# EasyEDA Pro project B1S.eprj

# Schematic Schematic1
Board Name: B1S_STD; Create Date: 2025-11-05; Page Name: P1; Project Name: B1S; Schematic Name: Schematic1; Update Date: 2025-11-11; Company: 嘉立创EDA; Page Size: A4; Version: V1.0
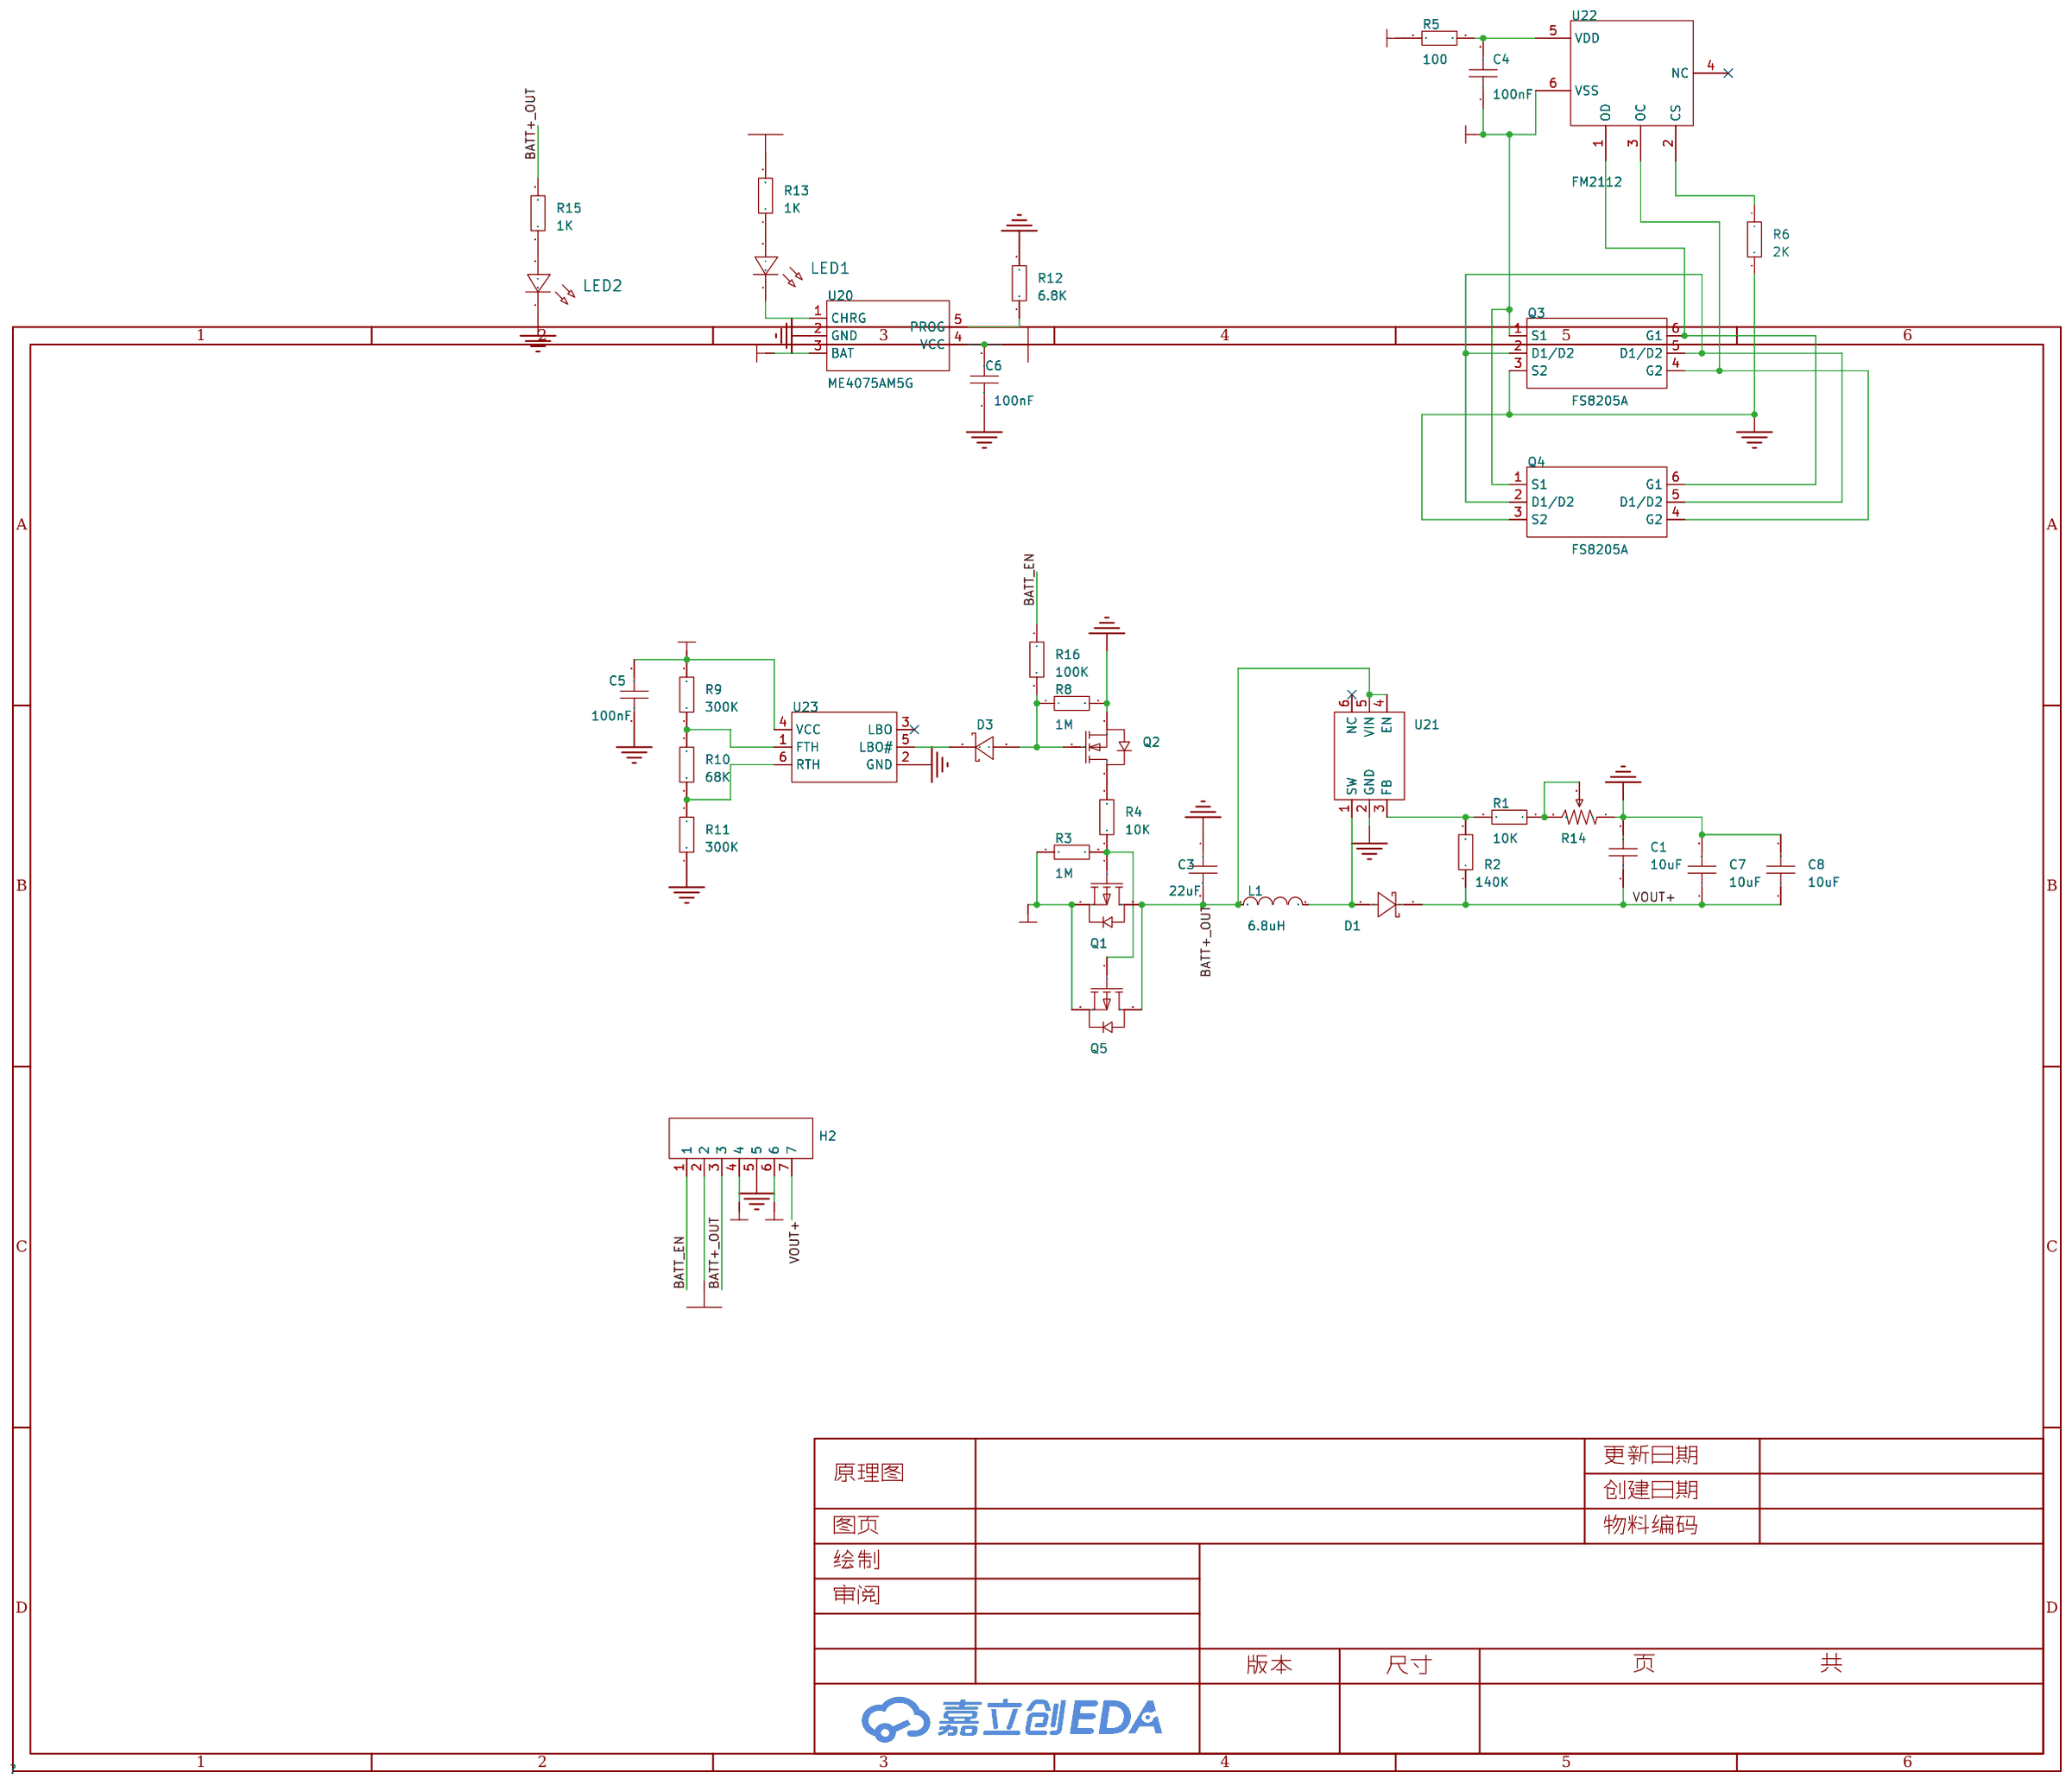
[diagram p0: schematic sheet]

## Parts
C1  10uF  [C0805]
C3  22uF  [C0805]
C4  100nF  [C0603]
C5  100nF  [C0603]
C6  100nF  [C0603]
C7  10uF  [C0805]
C8  10uF  [C0805]
D1  SS34  [SMA_L4.3-W2.6-LS5.0-FD]
D3  1N5819WS  [SOD-323_L1.8-W1.3-LS2.5-RD]
H2  -  [HDR-TH_7P-P2.54-V-F]
L1  6.8uH  [IND-SMD_L7.0-W6.6]
LED1  -  [LED_0603]
LED2  -  [LED_0603]
Q1  SI2305CDS-T1-GE3  [SOT-23-3_L2.9-W1.3-P1.90-LS2.4-BR]
Q2  SI2302  [SOT-23-3_L2.9-W1.3-P1.90-LS2.4-BR]
Q3  FS8205A  [SOT-23-6_L2.9-W1.6-P0.95-LS2.8-BR]
Q4  FS8205A  [SOT-23-6_L2.9-W1.6-P0.95-LS2.8-BR]
Q5  SI2305CDS-T1-GE3  [SOT-23-3_L2.9-W1.3-P1.90-LS2.4-BR]
R1  10K  [R0603]
R2  140K  [R0603]
R3  1M  [R0603]
R4  10K  [R0603]
R5  100  [R0603]
R6  2K  [R0603]
R8  1M  [R0603]
R9  300K  [R0603]
R10  68K  [R0603]
R11  300K  [R0603]
R12  6.8K  [R0603]
R13  1K  [R0603]
R14  500kΩ  [RES-ADJ-SMD_JER33X-1-14]
R15  1K  [R0603]
R16  100K  [R0603]
U20  ME4075AM5G  [SOT-23-5_L2.9-W1.6-P0.95-LS2.8-BL]
U21  SX1308  [SOT-23-6_L2.9-W1.6-P0.95-LS2.8-BL]
U22  FM2112  [SOT-23-6_L2.9-W1.6-P0.95-LS2.8-BL]
U23  CN312  [SOT-23-6_L2.9-W1.6-P0.95-LS2.8-BL]

## Library data of the parts
C1 C3 C7 C8 = CAP_0805: Supplier Footprint: 0805
C4-C6 = CAP_0603: Supplier Footprint: 0603
D1 = SS34_C7420365: LCSC Part Name: 电压:40V 电流:3A; Supplier Part: C7420365; Manufacturer: R+O(宏嘉诚); Supplier Footprint: SMA(DO-214AC); JLCPCB Part Class: 扩展库; Datasheet: https://item.szlcsc.com/datasheet/SS34/8397187.html; Supplier: LCSC; Diode Configuration: 独立式; Voltage - Forward(Vf@If): 550mV@3.0A; Voltage - DC Reverse(Vr): 40V; Current - Rectified: 3A; Reverse Leakage Current (Ir): 200uA@40V
D3 = 1N5819WS_C191023: LCSC Part Name: 电压:40V 电流:1A; Supplier Part: C191023; Manufacturer: Hottech(合科泰); Supplier Footprint: SOD-323; JLCPCB Part Class: 基础库; Datasheet: https://item.szlcsc.com/datasheet/1N5819WS/213850.html; Supplier: LCSC; Voltage - Forward(Vf@If): 600mV@1A; Voltage - DC Reverse(Vr): 40V; Current - Rectified: 1A; Non-Repetitive Peak Forward Surge Current: 25A
H2 = HDR-F_2.54_1x7P: Supplier Part: C124418; Supplier Footprint: 插件
L1 = FXL0630-6R8-M: LCSC Part Name: 6.8uH ±20% 6A; Supplier Part: C167221; Manufacturer: cjiang(长江微电); Supplier Footprint: SMD,7x6.6mm; JLCPCB Part Class: 扩展库; Datasheet: https://item.szlcsc.com/datasheet/FXL0630-6R8-M/178604.html; Supplier: LCSC; Tolerance: ±20%; Current Rating: 5A; Current - Saturation(Isat): 6A; DC Resistance(DCR): 48mΩ; Type: 一体成型电感
LED1 LED2 = LED_0603-R: Supplier Footprint: 0603
Q1 Q5 = SI2305CDS-T1-GE3: LCSC Part Name: 1个P沟道 耐压:8V 电流:4.4A; Supplier Part: C37577; Manufacturer: VISHAY(威世); Supplier Footprint: SOT-23; JLCPCB Part Class: 扩展库; Datasheet: https://item.szlcsc.com/datasheet/SI2305CDS-T1-GE3/38557.html; Supplier: LCSC; Number: 1个P沟道; Drain to Source Voltage: 8V; Current - Continuous Drain(Id): 5.8A; RDS(on): 65mΩ@1.8V; Pd - Power Dissipation: 1.7W; Gate Threshold Voltage (Vgs(th)): 1V@250uA; Gate Charge(Qg): 30nC@8V; Input Capacitance(Ciss): 96pF; Reverse Transfer Capacitance (Crss@Vds): 300pF; Operating Temperature: -55℃~+150℃; Type: P沟道; Output Capacitance(Coss): 330pF
Q2 = SI2302_C2891732: LCSC Part Name: N沟道,电流:3A,耐压:20V; Supplier Part: C2891732; Manufacturer: YONGYUTAI(永裕泰); Supplier Footprint: SOT-23; JLCPCB Part Class: 扩展库; Datasheet: https://item.szlcsc.com/datasheet/SI2302/3119651.html; Supplier: LCSC; Number: 1个N沟道; Drain to Source Voltage: 20V; Current - Continuous Drain(Id): 3A; RDS(on): 65mΩ@2.5V; Pd - Power Dissipation: 1W; Gate Threshold Voltage (Vgs(th)): 1V@250uA; Gate Charge(Qg): 4nC@4.5V; Input Capacitance(Ciss): 300pF; Reverse Transfer Capacitance (Crss@Vds): 80pF; Operating Temperature: -55℃~+150℃; Type: N沟道; Output Capacitance(Coss): 120pF
Q3 Q4 = FS8205A_C908265: LCSC Part Name: 2个N沟道 耐压:20V 电流:6A; Supplier Part: C908265; Manufacturer: FUXINSEMI(富芯森美); Supplier Footprint: SOT-23-6L; JLCPCB Part Class: 扩展库; Datasheet: https://atta.szlcsc.com/upload/public/pdf/source/20201027/C908265_C6F1A5E0FB14735EF799FEF607A99450.pdf; Supplier: LCSC; Type: 2个N沟道; Drain to Source Voltage: 20V; Current - Continuous Drain(Id): 6A; RDS(on): 18mΩ@4.5V,6A; Pd - Power Dissipation: 1.5W; Gate Threshold Voltage (Vgs(th)@Id): 1.2V; Gate Charge(Qg): 11nC@4.5V; Input Capacitance(Ciss@Vds): 800pF@8V; Reverse Transfer Capacitance (Crss@Vds): 125pF@8V; Operating Temperature: -55℃~+150℃@(Tj)
R1-R6 R8-R13 R15 R16 = Res_0603: Supplier Footprint: 0603
R14 = JER33X-1-55: Supplier Part: C48997889; Manufacturer: JIERR(捷而瑞); Supplier Footprint: SMD-3P,3.4x3.1mm; JLCPCB Part Class: 扩展库; Datasheet: https://item.szlcsc.com/datasheet/JER33X-1-55/51342025.html; Supplier: LCSC; Tolerance: ±25%; Power(Watts): 150mW; Temperature Coefficient: ±250ppm/℃; Number of Turns: 1
U20 = ME4075AM5G: LCSC Part Name: 单节磷酸铁锂电池充电芯片; Supplier Part: C558564; Manufacturer: MICRONE(南京微盟); Supplier Footprint: SOT-23-5; JLCPCB Part Class: 扩展库; Datasheet: https://atta.szlcsc.com/upload/public/pdf/source/20200525/C558564_88164DE9DE160E2D6FBDFD2D9E6A2859.pdf; Supplier: LCSC
U21 = SX1308: 功能类型:升压型;输出类型:可调;工作电压:2V~24V;输出电压:28V;输出电流:2A;; LCSC Part Name: 高效1.2MHz 2A升压转换器; Supplier Part: C78162; Manufacturer: SX(硕芯科技); Supplier Footprint: SOT-23-6; JLCPCB Part Class: 扩展库; Datasheet: https://atta.szlcsc.com/upload/public/pdf/source/20160920/1474356679185.pdf; Supplier: LCSC; Function: 升压型; Output Type: 可调; Voltage - Supply: 2V~24V; Output Voltage: 28V; Output Current: 2A; Frequency - Switching: 1.2MHz; Operating Temperature: -40℃~+85℃; Synchronous Rectifier: 否; Number of Outputs: 1; Topology: 升压式; Quiescent Current: 100uA; Switch tube (built-in/external): 内置
U22 = FM2112: Supplier Part: C255533; Manufacturer: FM(富满); Supplier Footprint: SOT-23-6; JLCPCB Part Class: 扩展库; Supplier: LCSC
U23 = CN312: Supplier Part: C7495114; Manufacturer: CONSONANCE(上海如韵); Supplier Footprint: SOT-23-6L; JLCPCB Part Class: 扩展库; Datasheet: https://atta.szlcsc.com/upload/public/pdf/source/20230915/A8641F2176FA560F6A2DB41CB2D84827.pdf; Supplier: LCSC

## Nets
GND: C1.2 C3.1 C5.1 C6.1 C7.2 C8.2 H2.5 LED2.1(C) Q2.2(S) Q3.3(S2) Q4.3(S2) R6.2 R8.2 R11.1 R12.2 R14.1 U20.2(GND) U21.2(GND) U23.2(GND)
BATT+: C5.2 H2.4 Q1.2(S) Q5.2(S) R3.1 R5.2 R9.2 U20.3(BAT) U23.4(VCC)
BATT+_OUT: C3.2 H2.3 L1.1 Q1.3(D) Q5.3(D) R15.2 U21.4(EN) U21.5(VIN)
BATT-: C4.1 H2.6 Q3.1(S1) Q4.1(S1) U22.6(VSS)
BATT_EN: H2.1 R16.1
CHG+: C6.2 H2.2 R13.2 U20.4(VCC)
VOUT+: C1.1 C7.1 C8.1 D1.2(K) H2.7 R2.1
$1N326: D1.1(A) L1.2 U21.1(SW)
$1N1131: Q1.1(G) Q5.1(G) R3.2 R4.1
$1N1181: Q2.3(D) R4.2
$1N1291: C4.2 R5.1 U22.5(VDD)
$1N2008: Q3.2(D1/D2) Q3.5(D1/D2) Q4.2(D1/D2) Q4.5(D1/D2)
$1N2061: Q3.4(G2) Q4.4(G2) U22.3(OC)
$1N2106: R6.1 U22.2(CS)
$1N3605: R9.1 R10.2 U23.1(FTH)
$1N3631: R10.1 R11.2 U23.6(RTH)
$1N3871: R12.1 U20.5(PROG)
$1N4089: LED1.1(C) U20.1(CHRG)
$1N4116: LED1.2(A) R13.1
$1N6899: LED2.2(A) R15.1
Net-(D3-1): D3.1(K) U23.5(LBO#)
Net-(D3-2): D3.2(A) Q2.1(G) R8.1 R16.2
Net-(Q3-6): Q3.6(G1) Q4.6(G1) U22.1(OD)
Net-(R1-1): R1.1 R14.2 R14.3
Net-(R1-2): R1.2 R2.2 U21.3(FB)

Not connected (* = marked no-connect by the designer): U21 6(NC)*; U22 4(NC)*; U23 3(LBO)*

# Board PCB1
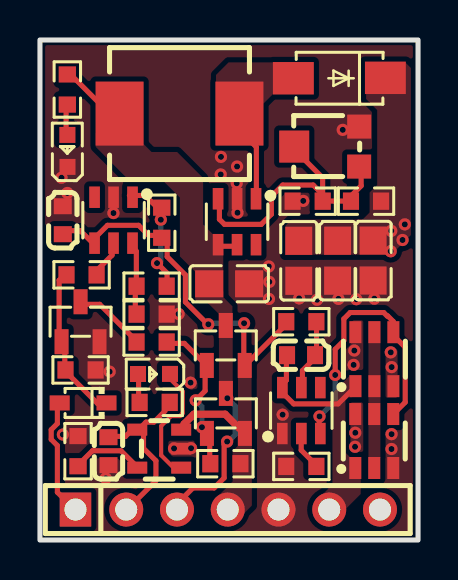
[diagram p1: board, top side]
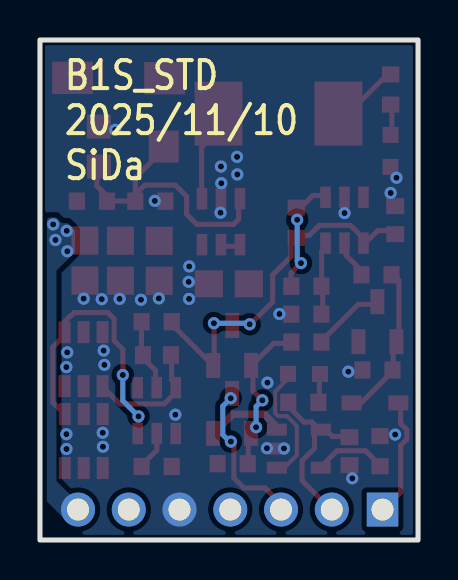
[diagram p2: board, bottom side, seen from below]

Outline 18.92 x 25.02 mm; copper layers: Top Layer, Bottom Layer. Coordinates in mm from the lower left corner of the outline.
Outline path: rectangle 0,25.02 18.92,0
Stack: Top Layer 0.035mm / Dielectric1 1.51mm FR4 er 4.5 / Bottom Layer 0.035mm

## Design rules (mm)
template: 自定义配置
spacing copperThickness1oz (default): track to track 0.102, other pairs 0.152 to 0.3
spacing copperThickness2oz: track to track 0.203, other pairs 0.152 to 0.3
track width copperThickness1oz (default): min 0.127, default 0.254, max 2.54
track width copperThickness2oz: min 0.203, default 0.254, max 2.54
differential pair differentialPair (default): width min 0.127, default 0.254, max 2.54; gap min 0.152, default 0.152
via viaSize (default): diameter min 0.5, default 0.61, max 10; hole min 0.3, default 0.305, max 6.3

## Placement (name value [footprint] x y rotation side)
C1  10uF  [C0805]  12.95 13.97 270 top
C3  22uF  [C0805]  9.47 12.82 180 top
C4  100nF  [C0603]  13.07 9.25 0 top
C5  100nF  [C0603]  1.14 16 270 top
C6  100nF  [C0603]  3.43 4.45 90 top
C7  10uF  [C0805]  16.67 13.98 270 top
C8  10uF  [C0805]  14.9 13.98 270 top
D1  SS34  [SMA_L4.3-W2.6-LS5.0-FD]  14.99 23.11 0 top
D2  1N5819WS  [SOD-323_L1.8-W1.3-LS2.5-RD]  2.16 6.86 180 top
H2  -  [HDR-TH_7P-P2.54-V-F]  9.4 1.52 0 top
L1  6.8uH  [IND-SMD_L7.0-W6.6]  6.99 21.34 0 top
LED1  -  [LED_0603]  5.66 8.3 180 top
LED2  -  [LED_0603]  1.37 19.52 90 top
Q1  SI2305CDS-T1-GE3  [SOT-23-3_L2.9-W1.3-P1.90-LS2.4-BR]  9.3 9.74 270 top
Q2  SI2302  [SOT-23-3_L2.9-W1.3-P1.90-LS2.4-BR]  2.03 10.92 270 top
Q3  FS8205A  [SOT-23-6_L2.9-W1.6-P0.95-LS2.8-BR]  16.74 9.05 270 top
Q4  FS8205A  [SOT-23-6_L2.9-W1.6-P0.95-LS2.8-BR]  16.73 4.95 270 top
Q5  SI2305CDS-T1-GE3  [SOT-23-3_L2.9-W1.3-P1.90-LS2.4-BR]  9.31 6.34 270 top
R1  10K  [R0603]  13.4 16.95 0 top
R2  140K  [R0603]  16.32 16.95 180 top
R3  1M  [R0603]  9.28 3.82 180 top
R4  10K  [R0603]  5.59 9.91 180 top
R5  100  [R0603]  13.08 10.92 180 top
R6  2K  [R0603]  13.08 3.68 180 top
R7  100K  [R0603]  2.08 13.27 0 top
R8  1M  [R0603]  2.03 8.51 0 top
R9  300K  [R0603]  6.1 15.88 270 top
R10  68K  [R0603]  5.59 12.7 0 top
R11  300K  [R0603]  5.59 11.3 180 top
R12  6.8K  [R0603]  1.91 4.45 90 top
R13  1K  [R0603]  5.74 6.89 0 top
R14  500kΩ  [RES-ADJ-SMD_JER33X-1-14]  14.35 19.69 90 top
R15  1K  [R0603]  1.37 22.54 90 top
U20  ME4075AM5G  [SOT-23-5_L2.9-W1.6-P0.95-LS2.8-BL]  5.97 4.57 90 top
U21  SX1308  [SOT-23-6_L2.9-W1.6-P0.95-LS2.8-BL]  9.87 15.93 180 top
U22  FM2112  [SOT-23-6_L2.9-W1.6-P0.95-LS2.8-BL]  13.08 6.48 0 top
U23  CN312  [SOT-23-6_L2.9-W1.6-P0.95-LS2.8-BL]  3.68 16 180 top

## Footprints (pads in the part's own frame, mm; a bottom-side part is the same pattern mirrored in y, then rotated)
C0603
  rect 0.8x0.9 smd: 1(-0.7,0) 2(0.7,0)
C0805
  rect 1.41x1.35 smd: 1(-1,0) 2(1,0)
HDR-TH_7P-P2.54-V-F
  rect 1.575x1.7 hole 1.1: 1(-7.62,0)
  round 1.7 hole 1.1: 2(-5.08,0) 3(-2.54,0) 4(0,0) 5(2.54,0) 6(5.08,0) 7(7.62,0)
IND-SMD_L7.0-W6.6
  rect 2.4x3.2 smd: 1(-3,0) 2(3,0)
LED_0603
  rect 0.8x0.8 smd: 1(-0.851,-0.01) 2(0.75,-0.005)
R0603
  rect 0.806x0.864 smd: 1(-0.753,0) 2(0.753,0)
RES-ADJ-SMD_JER33X-1-14
  rect 1.2x1.2 smd: 1(1,-1.625) 3(-1,-1.625)
  rect 1.6x1.5 smd: 2(0,1.625)
SMA_L4.3-W2.6-LS5.0-FD
  rect 2.046x1.62 smd: 1(-2.304,-0.009) 2(2.304,0.009)
SOD-323_L1.8-W1.3-LS2.5-RD
  rect 1x0.75 smd: 1(-1.173,0) 2(1.173,0)
SOT-23-3_L2.9-W1.3-P1.90-LS2.4-BR
  rect 1.25x0.7 smd: 1(1,-0.95) 2(1,0.95) 3(-1,0)
SOT-23-5_L2.9-W1.6-P0.95-LS2.8-BL
  rect 0.6x1 smd: 1(-0.95,-1.1) 2(0,-1.1) 3(0.95,-1.1) 4(0.95,1.1) 5(-0.95,1.1)
SOT-23-6_L2.9-W1.6-P0.95-LS2.8-BL
  rect 0.532x1.072 smd: 1(-0.95,-1.149) 2(0,-1.149) 3(0.95,-1.149) 4(0.95,1.149) 5(0,1.149) 6(-0.95,1.149)
SOT-23-6_L2.9-W1.6-P0.95-LS2.8-BR
  rect 1.1x0.6 smd: 1(1.35,-0.95) 2(1.35,0) 3(1.35,0.95) 4(-1.35,0.95) 5(-1.35,0) 6(-1.35,-0.95)

## Nets
GND: C1.2 C3.1 C5.1 C6.1 C7.2 C8.2 H2.5 LED2.1 Q2.2 Q3.3 Q3.6 Q4.3 Q4.6 R1.1 R6.2 R8.2 R11.1 R12.2 R14.1 U20.2 U21.2 U22.1 U23.2
BATT+: C5.2 H2.4 Q1.2 Q5.2 R3.1 R5.2 R9.2 U20.3 U23.4
BATT+_OUT: C3.2 H2.3 L1.1 Q1.3 Q5.3 R15.2 U21.4 U21.5
BATT-: C4.1 H2.6 Q3.1 Q4.1 U22.6
BATT_EN: D2.2 H2.1
CHG+: C6.2 H2.2 R13.2 U20.4
VOUT+: C1.1 C7.1 C8.1 D1.2 H2.7 R2.1
$1N326: D1.1 L1.2 U21.1
$1N498: R1.2 R2.2 R14.2 R14.3 U21.3
$1N1131: Q1.1 Q5.1 R3.2 R4.1
$1N1181: Q2.3 R4.2
$1N1291: C4.2 R5.1 U22.5
$1N2008: Q3.2 Q3.5 Q4.2 Q4.5
$1N2061: Q3.4 Q4.4 U22.3
$1N2106: R6.1 U22.2
$1N2767: D2.1 Q2.1 R7.1 R8.1
$1N3605: R9.1 R10.2 U23.1
$1N3631: R10.1 R11.2 U23.6
$1N3806: R7.2 U23.5
$1N3871: R12.1 U20.5
$1N4089: LED1.1 U20.1
$1N4116: LED1.2 R13.1
$1N6899: LED2.2 R15.1

Pads without a net: U21 6; U22 4; U23 3

## Via types
v1: diameter 0.61, hole 0.305, Top Layer to Bottom Layer, 48 vias

## Routing (per net, layer and track width the routed paths; a pad name or vN(x,y) marks a point on that pad's centre or on a via; arc(x,y) is an arc through that point)
GND:
  vias: v1(1.08,18.13) v1(1.15,5.28) v1(1.37,17.36) v1(3.29,3.09) v1(3.49,8.42) v1(3.68,16.36) v1(6.71,4.58) v1(6.94,11.31) v1(7.54,7.87) v1(7.56,4.59) v1(9.06,19.17) v1(9.05,18.29) v1(9.87,18.69) v1(9.85,17.85) v1(9.89,16.38) v1(11.45,13.69) v1(11.48,12.92) v1(11.46,12.06) v1(12.15,6.27) v1(12.97,12.09) v1(13.18,16.97) v1(13.87,12.02) v1(14.94,12.06) v1(15.15,20.52) v1(15.7,8.76) v1(15.73,9.48) v1(15.78,5.37) v1(15.77,4.67) v1(15.83,12.05) v1(16.74,12.08) v1(17.56,9.39) v1(17.6,8.65) v1(17.6,5.3) v1(17.59,4.55)
BATT+: length 21
  Top Layer w0.254: 5.95,15.24 5.44,15.24 4.94,15.75 3.38,15.75 2.65,15.01 2.65,15 2.75,14.89 ; 10.37,8.84 12.12,10.59 12.12,10.94 ; 1.26,15.48 2.02,15.48 2.74,14.76 ; 6.37,14.92 6.37,14.17 7.28,13.26 7.28,11.91 8.43,10.76 ; v1(10.22,10.85) 10.2,10.83 10.2,8.84
  Top Layer w0.363: 7.21,5.48 7.21,5.81 7.7,6.29 9.27,6.29 9.97,5.59
  Bottom Layer w0.254: v1(8.43,10.8) 8.48,10.85 v1(10.22,10.85)
BATT+_OUT: length 11.2
  Top Layer w0.254: 6.93,1.88 7.66,2.61 8.72,2.61 9.22,3.11 9.22,4.77 v1(9.37,4.93) ; 1.39,23.34 1.49,23.34 3.52,21.31 ; 8.93,14.7 9.78,14.7 9.87,14.79
  Bottom Layer w0.254: v1(9.37,4.93) 9.43,4.93 9.77,5.27 9.77,6.7 v1(9.38,7.09)
BATT-: length 5.6
  Top Layer w0.254: 15.72,7.61 14.92,6.81 12.7,6.81 12.23,7.28 12.23,7.42 ; 12.13,7.79 12.34,8 12.34,9.18
BATT_EN: length 6
  Top Layer w0.254: 1.82,1.44 0.87,2.39 0.87,4.73 0.56,5.04 0.56,5.52 0.87,5.83 0.87,6.62 0.77,6.73
CHG+: length 7.4
  Top Layer w0.254: 5,5.59 5.31,5.9 5.7,5.9 6.26,6.46 ; 3.5,5.18 4.28,5.18 4.6,5.5 ; 5.18,5.4 5.18,4.59 5.8,3.97 5.8,2.97 4.47,1.63
VOUT+:
  vias: v1(17.58,15.47) v1(17.55,14.45) v1(18.15,15.01) v1(18.26,15.79)
$1N326: length 3.1
  Top Layer w0.254: 10.46,20.04 10.83,19.66 10.83,17.11
$1N498: length 14.1
  Top Layer w0.254: 12.73,19.55 14.15,18.12 14.15,16.96 ; 14.14,16.96 14.15,16.96 ; 14.15,16.96 15.31,16.96 16.08,17.72 16.08,18.58 ; 14.15,16.96 14.15,16.92 ; 8.98,17.04 8.98,16.05 9.24,15.79 11.08,15.79 11.58,16.3 11.58,17.19 12.15,17.76 13.68,17.76 14.14,17.3
$1N1131: length 6.9
  Top Layer w0.254: 8.27,8.43 8.27,7.46 v1(7.79,6.99) ; 8.5,3.85 8.5,5.05 8.32,5.23 ; 8.27,8.79 7.23,9.84 6.39,9.84
  Bottom Layer w0.254: v1(7.79,6.99) 8.11,6.68 v1(8.11,5.64)
$1N1181: length 3.3
  Top Layer w0.254: 2.19,11.79 2.99,11.79 4.75,10.03
$1N1291: length 3.2
  Top Layer w0.254: 13.82,10.88 13.84,10.86 13.84,9.27 ; 13.69,9.03 13.14,8.48 13.14,7.68
$1N2061: length 13.3
  Top Layer w0.254: 17.63,6.47 17.86,6.47 18.28,6.89 18.28,9.64 17.91,10.01 ; 17.68,10.77 17.68,10.94 17.41,11.21 17.38,11.21 17.21,11.38 15.53,11.38 15.21,11.06 15.21,9.98 14.78,9.54 v1(14.78,8.26) ; v1(13.99,6.19) 13.97,6.17 13.97,5.36
  Bottom Layer w0.254: v1(13.99,6.19) 14.78,6.97 v1(14.78,8.26)
$1N2106: length 1.7
  Top Layer w0.254: 13.07,5.13 13.07,4.5 13.84,3.73
$1N2767: length 7.5
  Top Layer w0.254: 1.17,9.96 1.24,9.88 1.24,8.41 ; 1.32,13.36 0.96,13 0.96,10.18 ; 3.39,6.83 2.89,6.83 1.41,8.3
$1N3605: length 5.8
  Top Layer w0.254: 5.96,16.54 5.27,17.24 4.48,17.24 ; 6.36,12.87 6.36,13.35 v1(5.86,13.86) ; v1(6.05,16.03) 6.01,16.06 6.01,16.52
  Bottom Layer w0.254: v1(5.86,13.86) 5.95,13.86 6.05,13.96 v1(6.05,16.03)
$1N3631: length 3.4
  Top Layer w0.254: 4.77,12.75 4.77,11.59 5.03,11.33 ; 4.82,12.83 4.82,14.44 4.62,14.65
$1N3806: length 1.5
  Top Layer w0.254: 3.61,14.57 3.61,14.25 2.77,13.41
$1N3871: length 3.4
  Top Layer w0.254: 2.01,3.86 2.62,4.47 4.06,4.47 4.85,3.67
$1N4089: length 6.1
  Top Layer w0.203: 6.95,3.61 6.7,3.61 6.07,4.24 6.07,5.71 6.56,6.2 7,6.2 7.15,6.35 7.15,7.42 6.56,8.02 6.56,8.21
$1N4116: length 1.4
  Top Layer w0.254: 4.97,8.19 4.94,8.16 4.94,6.8
$1N6899: length 1.3
  Top Layer w0.254: 1.39,21.6 1.31,21.52 1.31,20.36

## Copper pours and planes (outline as drawn; the poured copper is in the pictures)
GND on Top Layer: -0.47,25.47 19.64,25.47 19.64,-0.92 -0.47,-0.92
GND on Bottom Layer: -0.55,25.52 19.78,25.52 19.78,-1.08 -0.55,-1.08
BATT+ on Top Layer: 9.91,8.33 10.59,8.33 10.59,5.84 9.91,5.84
BATT+ on Top Layer: 8.7,4.87 10.61,4.87 10.61,1.06 8.7,1.06
BATT+_OUT on Top Layer: 7.77,12.44 9.63,12.44 9.63,11.18 7.77,11.18
BATT+_OUT on Top Layer: 8.96,10.23 9.65,10.23 9.65,7.59 8.96,7.59
BATT+_OUT on Top Layer: 2.79,22.05 9.17,22.05 9.17,13.4 2.79,13.4
BATT- on Top Layer: 14.07,8.24 16.05,8.24 16.05,1.49 14.07,1.49
VOUT+ on Top Layer: 12.29,23.9 18.57,23.9 18.57,14.27 12.29,14.27
VOUT+ on Bottom Layer: 16.55,16.14 18.58,16.14 18.58,0.96 16.55,0.96
$1N326 on Top Layer: 8.81,23.9 12.57,23.9 12.57,21.54 8.81,21.54
$1N2008 on Top Layer: 16.44,10.95 17.04,10.95 17.04,3.99 16.44,3.99

## Text on the board
Bottom Silkscreen Layer: B1S_STD / 2025/11/10 / SiDa
